# Altium schematic sheet Sheet2.SchDoc
size A
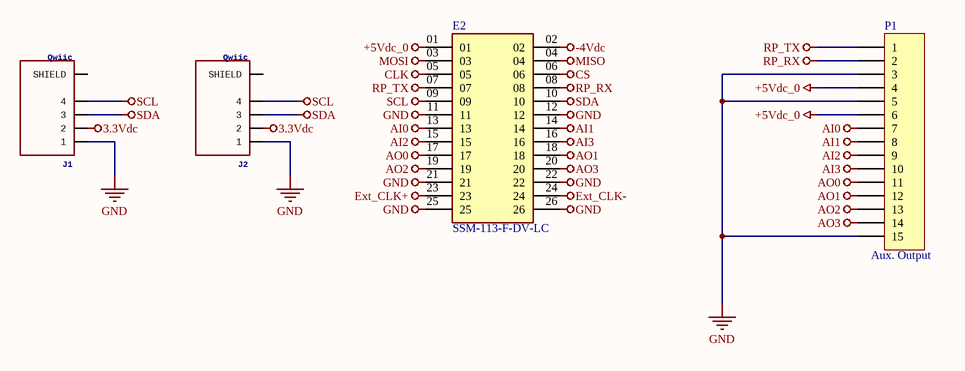
[diagram p0: Sheet2.SchDoc]

## Parts
E2  SSM-113-F-DV-LC  [SAMTEC_SSM-113-F-DV-LC]
J1  Qwiic  [4P RIGHT]
J2  Qwiic  [4P RIGHT]
P1  Aux. Output  [15P RIGHT]

## Nets
3.3Vdc: J1.2 J2.2
+5Vdc_0: E2.01 P1.4 P1.6
-4Vdc: E2.02
AI0: E2.13 P1.7
AI1: E2.14 P1.8
AI2: E2.15 P1.9
AI3: E2.16 P1.10
AO0: E2.17 P1.11
AO1: E2.18 P1.12
AO2: E2.19 P1.13
AO3: E2.20 P1.14
CLK: E2.05
CS: E2.06
Ext_CLK+: E2.23
Ext_CLK-: E2.24
GND: E2.11 E2.12 E2.21 E2.22 E2.25 E2.26 J1.1 J2.1 P1.3 P1.5 P1.15
MISO: E2.04
MOSI: E2.03
RP_RX: E2.08 P1.2
RP_TX: E2.07 P1.1
SCL: E2.09 J1.4 J2.4
SDA: E2.10 J1.3 J2.3

Not connected (* = marked no-connect by the designer): J1 S1 S2(SHIELD); J2 S1 S2(SHIELD)

## Library data of the parts
J1 J2 = SM04B-SRSS-TB(LF)(SN): GateName_1: G$2; MF: JST Sales; SymbolName_1: SM04B-SRSS-TB(LF)(SN); LibraryName: SM04B-SRSS-TB_LF__SN; DeviceSetName: SM04B-SRSS-TB(LF)(SN); Package: None; MP: SM04B-SRSS-TB(LF)(SN); Purchase-URL: https://pricing.snapeda.com/search/part/SM04B-SRSS-TB(LF)(SN)/?ref=eda; Availability: In Stock; Price: None
P1 = Header 15: Header, 15-Pin; LatestRevisionDate: 17-Jul-2002; LatestRevisionNote: Re-released for DXP Platform.; Publisher: Altium Limited
E2 = SSM-113-F-DV-LC: Value: *; Availability: Unavailable; Price: None; MP: SSM-113-F-DV-LC; Package: None